# EAGLE schematic AdaptadorWifi (EAGLE 6.5.0)
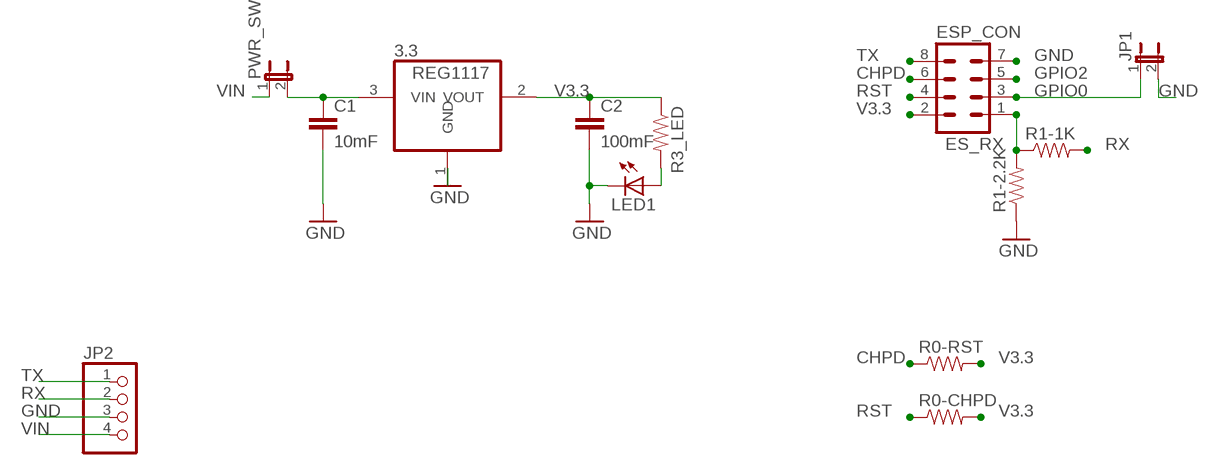
[diagram p0: schematic, sheet 1]

## Parts
3.3  REG1117  [SOT223]
C1  10mF  CAP1206  [1206]
C2  100mF  CAP1206  [1206]
ESP_CON  MA04-2  [MA04-2]
JP1  JUMPER-2PTH  [1X02]
JP2  PINHD-1X4/90  [1X04/90]
LED1  LED1206  [LED-1206]
PWR_SW  JUMPER-2PTH  [1X02]
R0-CHPD  RESISTOR1206  [1206]
R0-RST  RESISTOR1206  [1206]
R1-1K  RESISTOR1206  [1206]
R1-2.2K  RESISTOR1206  [1206]
R3_LED  RESISTOR1206  [1206]

## Nets
CHPD: ESP_CON.6 R0-RST.1
ES_RX: ESP_CON.1 R1-1K.1 R1-2.2K.2
GND: 3.3.1(GND) C1.2 C2.2 ESP_CON.7 JP1.2 JP2.3 LED1.C R1-2.2K.1
GPIO0: ESP_CON.3 JP1.1
GPIO2: ESP_CON.5
N$1: LED1.A R3_LED.2
N$2: 3.3.3(VIN) C1.1 PWR_SW.2
RST: ESP_CON.4 R0-CHPD.1
RX: JP2.2 R1-1K.2
TX: ESP_CON.8 JP2.1
V3.3: 3.3.2(VOUT) C2.1 ESP_CON.2 R0-CHPD.2 R0-RST.2 R3_LED.1
VIN: JP2.4 PWR_SW.1

## Library data of the parts
3.3 = burr-brown:REG1117: 800mA and 1A Low Dropout (LDO) Positive Regulator 1.8V, 2.5V, 2.85V, 3.3V, 5V, and Adj; MPN: REG1117; OC_FARNELL: 1097566; OC_NEWARK: 14P6981
C1 C2 = SparkFun:CAP: Capacitor Standard 0603 ceramic capacitor, and 0.1" leaded capacitor.
ESP_CON = con-lstb:MA04-2: PIN HEADER; OC_FARNELL: unknown; OC_NEWARK: unknown
JP1 PWR_SW = SparkFun:JUMPER-2: Jumper Basic 0.1" spaced jumper. Use with breakaway headers.
JP2 = pinhead:PINHD-1X4: PIN HEADER
LED1 = SparkFun:LED: LEDs Standard schematic elements and footprints for 5mm, 3mm, 1206, and 0603 sized LEDs. 5mm - Spark Fun Electronics SKU : COM-00529 (and others)
R0-CHPD R0-RST R1-1K R1-2.2K R3_LED = SparkFun:RESISTOR: Resistor Basic schematic elements and footprints for 0603, 1206, and PTH resistors.